# Altium project KATADC_V1-3.PrjPCB (part 2 of 3)

## Sheet ADC-QCHANNEL INPUT.SchDoc: <SPECIFIC SHEET FUNCTION>
size A3; Date: DO NOT USE, RATHER USE PROJ OPTIONS; DrawnBy: DO NOT USE, RATHER USE PROJ OPTIONS; Engineer: DO NOT USE, RATHER USE PROJ OPTIONS; Organization: DO NOT USE, RATHER USE PROJ OPTIONS; DocumentNumber: 2; Revision: DO NOT USE, RATHER USE PROJ OPTIONS; SheetNumber: 2; SheetTotal: 12; SCH_Sheet_Filename: ADC-QCHANEL INPUT.SchDoc; CurrentTime: DO NOT USE, RATHER USE PROJ OPTIONS; Time: DO NOT USE, RATHER USE PROJ OPTIONS; DocumentFullPathAndName: DO NOT USE, RATHER USE PROJ OPTIONS; DocumentName: DO NOT USE, RATHER USE PROJ OPTIONS; ModifiedDate: DO NOT USE, RATHER USE PROJ OPTIONS; ImagePath: DO NOT USE, RATHER USE PROJ OPTIONS
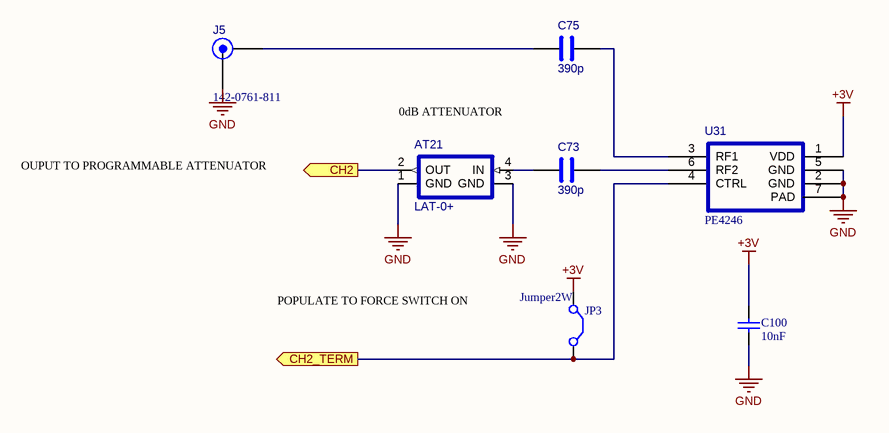
[diagram p6: ADC-QCHANNEL INPUT.SchDoc]

### Parts
AT21  (no value)  [MINICIRCUITS_MMM168]
C73  value 390p  [CAPC1005X55N]  (hidden comment: *)
C75  value 390p  [CAPC1005X55N]  (hidden comment: *)
C100  value 10nF  [CAPC1005X55N]  (hidden comment: Capacitor 0402 SMD)
J5  (no value)  [EDGE_LAUNCH_TH_SMA]
JP3  Jumper2W  [JUMPER]
U31  PE4246  [PSON95P300X300X90-7USR]

### Ports
CH2 (out), CH2_TERM (out)

### Nets
+3V: C100.1 JP3.1(C1) U31.1(VDD)
GND: AT21.1(GND) AT21.3(GND) C100.2 J5.2 U31.2(GND) U31.5(GND) U31.7(PAD)
CH2: AT21.2(OUT) ; port CH2
CH2_TERM: JP3.2(C2) U31.4(CTRL) ; port CH2_TERM
NetAT21_4: AT21.4(IN) C73.2
NetC73_1: C73.1 U31.6(RF2)
NetC75_1: C75.1 J5.1
NetC75_2: C75.2 U31.3(RF1)

### Notes on the sheet
- 0dB ATTENUATOR
- OUPUT TO PROGRAMMABLE ATTENUATOR
- POPULATE TO FORCE SWITCH ON
- 2009   THIS DOCUMENT IS THE PROPERTY OF THE OWNER, AND MAY NOT BE COPIED OR USED FOR ANY PURPOSE OTHER THAN THAT FOR WHICH IT IS SUPPLIED WITHOUT PERMISSION IN WRITING FROM THE OWNER.
- C
- DATESTAMP OF THIS PRINT
- DRAWN BY:
- DOCUMENT NUMBER:
- SCHEMATIC FILENAME:
- PCB FILENAME:
- ENGINEER:
- APPROVED:
- CIRCUIT DIAGRAM
- DATE
- SHEET
- REVISION
- OF

### Library data of the parts
AT21 = LAT-0+: Fixed Attenuator; Manufacturer: Mini-Circuits; Created_By: CT; Checked_By: *; Checked_Date: *; HelpURL: X:\Datasheets\By_Manufacturer\Mini Circuits\LAT-0+.pdf; ComponentLink1Description: Fixed Attenuator; ComponentLink1URL: *; ComponentLink2Description: Application Note; ComponentLink2URL: *; ComponentLink3Description: Layout Guidelines; ComponentLink3URL: *; ComponentLink4Description: Technology Reference; ComponentLink4URL: *; Supplier1: *; Supplier2: *; Unit_Cost: *; MOQ: *; Leadtime: *; Inventory_Stock: *; Tolerance: *; Wattage: *; Voltage: *; Package: *; ComponentLink5Description: Production Detail; ComponentLink5URL: *; Note: *; Stock Code: *; Manufacturer_PN: LAT-0+
C73 C75 = CAP-0603: CAP SMD 0603; Manufacturer: *; Manufacturer_PN: *; Created_By: *; Checked_By: *; Checked_Date: *; HelpURL: *; ComponentLink1Description: Footprint Detail; ComponentLink1URL: *; ComponentLink2Description: Application Note; ComponentLink2URL: *; ComponentLink3Description: Layout Guidelines; ComponentLink3URL: *; ComponentLink4Description: Technology Reference; ComponentLink4URL: *; Supplier1: *; Supplier2: *; Unit_Cost: *; MOQ: *; Leadtime: *; Inventory_Stock: *; Tolerance: *; Wattage: *; Voltage: *; Package: 0603; ComponentLink5Description: Production Detail; ComponentLink5URL: *; Note: *; Stock Code: *
C100 = cap0402: Created_By: EDA-ASA; Checked_By: *; Checked_Date: *; HelpURL: *; Supplier1: *; Supplier2: *; Unit_Cost: *; MOQ: *; Leadtime: *; Inventory_Stock: *; Tolerance: *; Wattage: *; Package: 0402; ComponentLinked1Description: *; ComponentLinked1URL: *; ComponentLinked2Description: *; ComponentLinked2URL: *; ComponentLinked3Description: *; ComponentLinked3URL: *; ComponentLinked4Description: *; ComponentLinked4URL: *
J5 = 142-0761-811: High Frequency SMA End Lauch Connector; Manufacturer: JOHNSON; Created_By: CT; Voltage: ???; Checked_By: *; Checked_Date: *; HelpURL: *; ComponentLink1Description: High Frequency SMA End Lauch Connector; ComponentLink1URL: *; ComponentLink2Description: Application Note; ComponentLink2URL: *; ComponentLink3Description: Layout Guidelines; ComponentLink3URL: *; ComponentLink4Description: Technology Reference; ComponentLink4URL: *; Supplier1: *; Supplier2: *; Unit_Cost: *; MOQ: *; Leadtime: *; Inventory_Stock: *; Tolerance: *; Wattage: *; Package: *; ComponentLink5Description: Production Detail; ComponentLink5URL: *; Note: *; Stock Code: *; Manufacturer_PN: 142-0761-811
JP3 = Jumper2W: Jumper Wire; Published: 24-Mar-1999; LatestRevisionDate: 17-Jul-2002; LatestRevisionNote: Re-released for DXP Platform.; PackageReference: RAD-0.2; Publisher: Altium Limited
U31 = PE4246: Absorptive SPST UltraCMOS RF Switch; Manufacturer: Pergrime Semiconductor; Created_By: IN; Manufacturer_PN: PE4246; Checked_By: *; Checked_Date: *; HelpURL: X:\Datasheets\By Manufacturer\Pergrime\pe4246ds.pdf; ComponentLink1Description: X:\Datasheets\By Manufacturer\Pergrime\pe4246ds.pdf#page=5; ComponentLink1URL: *; ComponentLink2Description: Application Note; ComponentLink2URL: *; ComponentLink3Description: Layout Guidelines; ComponentLink3URL: *; ComponentLink4Description: Technology Reference; ComponentLink4URL: *; Supplier1: *; Supplier2: *; Unit_Cost: *; MOQ: *; Leadtime: *; Inventory_Stock: *; Tolerance: *; Wattage: *; Voltage: *; Package: *; ComponentLink5Description: Production Detail; ComponentLink5URL: *; Note: *; Stock Code: *

## Sheet ADC-Q CHANNEL GAIN CONTROL.SchDoc: <SPECIFIC SHEET FUNCTION>
size A3; Date: DO NOT USE, RATHER USE PROJ OPTIONS; DrawnBy: DO NOT USE, RATHER USE PROJ OPTIONS; Engineer: DO NOT USE, RATHER USE PROJ OPTIONS; Organization: DO NOT USE, RATHER USE PROJ OPTIONS; DocumentNumber: 11; Revision: DO NOT USE, RATHER USE PROJ OPTIONS; SheetNumber: 11; SheetTotal: 12; SCH_Sheet_Filename: ADC-Q CHANNEL GAIN CONTROL.SchDoc; CurrentTime: DO NOT USE, RATHER USE PROJ OPTIONS; Time: DO NOT USE, RATHER USE PROJ OPTIONS; DocumentFullPathAndName: DO NOT USE, RATHER USE PROJ OPTIONS; DocumentName: DO NOT USE, RATHER USE PROJ OPTIONS; ModifiedDate: DO NOT USE, RATHER USE PROJ OPTIONS; ImagePath: DO NOT USE, RATHER USE PROJ OPTIONS
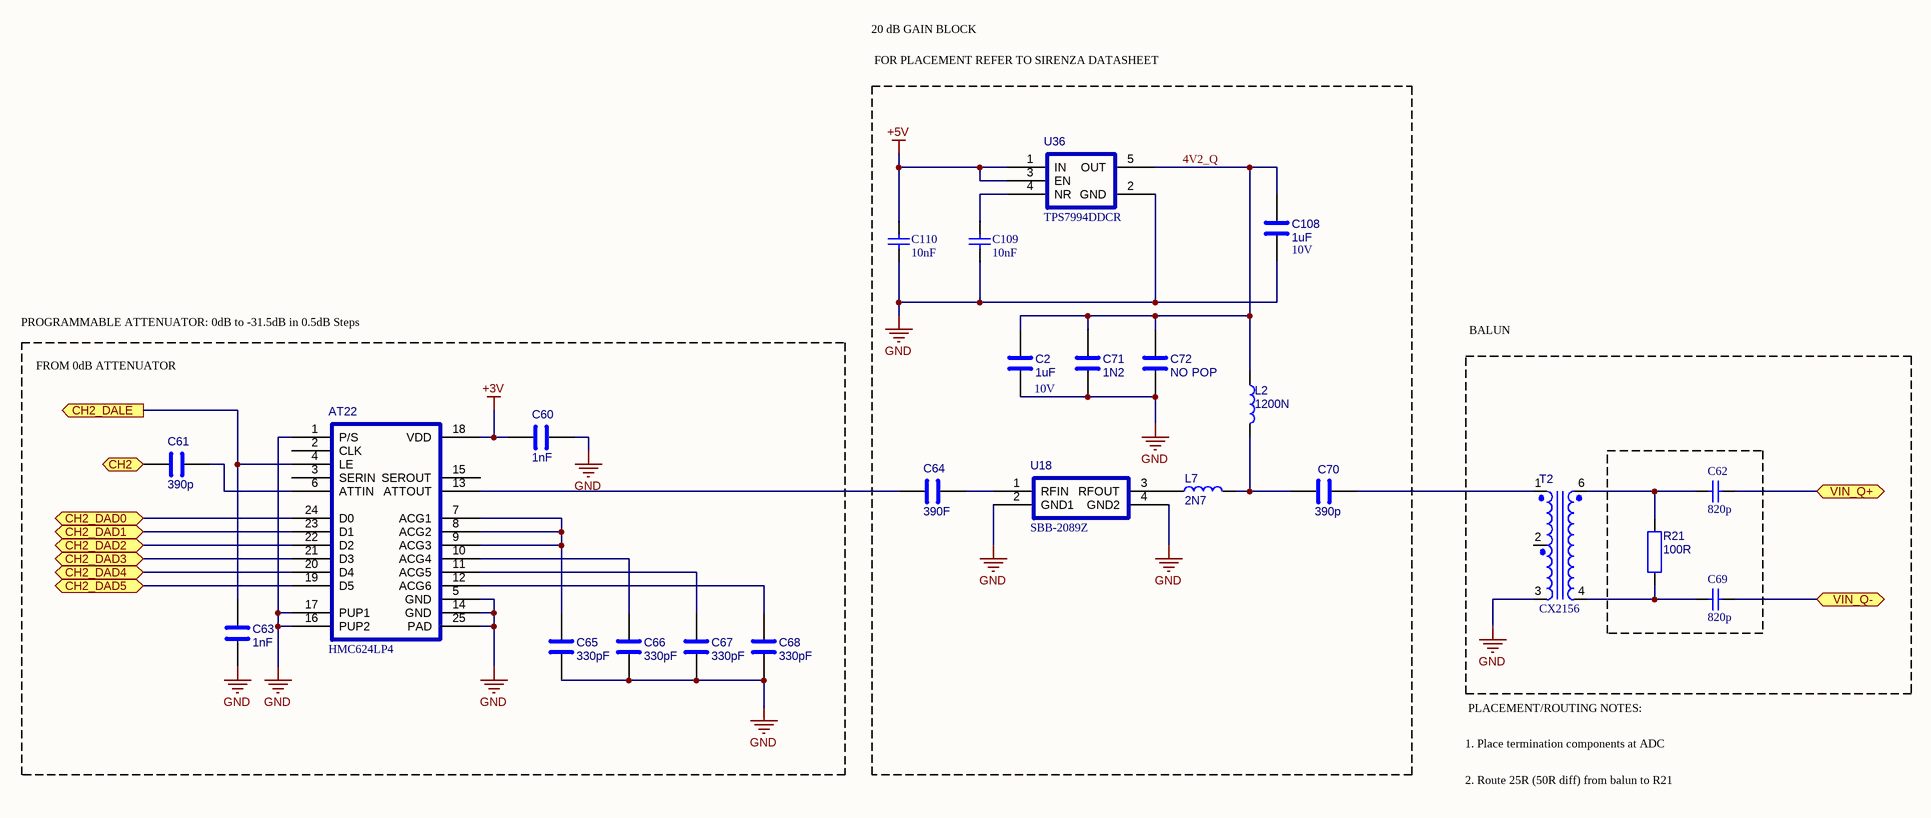
[diagram p7: ADC-Q CHANNEL GAIN CONTROL.SchDoc]

### Parts
AT22  HMC624LP4  [QFN50P400X400X100-25USR]
C2  value 1uF  Voltage: 10V  [CAPC1632X80USR]  (hidden comment: *)
C60  value 1nF  [0603]  (hidden comment: Footprint ???)
C61  value 390p  [CAPC1005X55N]  (hidden comment: *)
C62  value 820p  [CAPC1005X55N]  (hidden comment: Capacitor 0402 SMD)
C63  value 1nF  [0603]  (hidden comment: *)
C64  value 390F  [CAPC1005X55N]  (hidden comment: *)
C65  value 330pF  [0603]  (hidden comment: *)
C66  value 330pF  [0603]  (hidden comment: *)
C67  value 330pF  [0603]  (hidden comment: *)
C68  value 330pF  [0603]  (hidden comment: *)
C69  value 820p  [CAPC1005X55N]  (hidden comment: Capacitor 0402 SMD)
C70  value 390p  [CAPC1005X55N]  (hidden comment: Footprint ???)
C71  value 1N2  [CAPC1005X55N]  (hidden comment: *)
C72  value NO POP  [CAPC1005X55N]  (hidden comment: *)
C108  value 1uF  Voltage: 10V  [CAPC1632X80USR]  (hidden comment: Footprint ???)
C109  value 10nF  [CAPC1005X55N]  (hidden comment: Capacitor 0402 SMD)
C110  value 10nF  [CAPC1005X55N]  (hidden comment: Capacitor 0402 SMD)
L2  value 1200N  [INDM2520X160N]
L7  value 2N7  [INDC1005X60N]
R21  100R  [RESC1005X40N]
T2  CX2156  [PULSE_KAYAK]
U18  SBB-2089Z  [SIRENZA_SOT89]
U36  TPS7994DDCR  [SOT95P280X110-5USR]

### Ports
CH2 (out), CH2_DAD0, CH2_DAD1, CH2_DAD2, CH2_DAD3, CH2_DAD4, CH2_DAD5, CH2_DALE (out), VIN_Q+, VIN_Q-

### Nets
+3V: AT22.18(VDD) C60.1
+5V: C110.1 U36.1(IN) U36.3(EN)
GND: AT22.1(P/S) AT22.5(GND) AT22.14(GND) AT22.16(PUP2) AT22.17(PUP1) AT22.25(PAD) C2.2 C60.2 C63.2 C65.2 C66.2 C67.2 C68.2 C71.2 C72.2 C108.2 C109.2 C110.2 T2.3 U18.2(GND1) U18.4(GND2) U36.2(GND)
4V2_Q: C2.1 C71.1 C72.1 C108.1 L2.1 U36.5(OUT)
CH2: C61.1 ; port CH2
CH2_DAD0: AT22.24(D0) ; port CH2_DAD0
CH2_DAD1: AT22.23(D1) ; port CH2_DAD1
CH2_DAD2: AT22.22(D2) ; port CH2_DAD2
CH2_DAD3: AT22.21(D3) ; port CH2_DAD3
CH2_DAD4: AT22.20(D4) ; port CH2_DAD4
CH2_DAD5: AT22.19(D5) ; port CH2_DAD5
CH2_DALE: AT22.4(LE) C63.1 ; port CH2_DALE
VIN_Q+: C62.2 ; port VIN_Q+
VIN_Q-: C69.2 ; port VIN_Q-
NetAT22_6: AT22.6(ATTIN) C61.2
NetAT22_7: AT22.7(ACG1) AT22.8(ACG2) AT22.9(ACG3) C65.1
NetAT22_10: AT22.10(ACG4) C66.1
NetAT22_11: AT22.11(ACG5) C67.1
NetAT22_12: AT22.12(ACG6) C68.1
NetAT22_13: AT22.13(ATTOUT) C64.1
NetC62_1: C62.1 R21.1 T2.6
NetC64_2: C64.2 U18.1(RFIN)
NetC69_1: C69.1 R21.2 T2.4
NetC70_1: C70.1 L2.2 L7.2
NetC70_2: C70.2 T2.1
NetC109_1: C109.1 U36.4(NR)
NetL7_1: L7.1 U18.3(RFOUT)

Not connected (* = marked no-connect by the designer): AT22 2(CLK) 3(SERIN) 15(SEROUT); T2 2

### Notes on the sheet
- 20 dB GAIN BLOCK
- FOR PLACEMENT REFER TO SIRENZA DATASHEET
- PROGRAMMABLE ATTENUATOR: 0dB to -31.5dB in 0.5dB Steps
- FROM 0dB ATTENUATOR
- BALUN
- PLACEMENT/ROUTING NOTES:
- 1. Place termination components at ADC
- 2. Route 25R (50R diff) from balun to R21
- 2009   THIS DOCUMENT IS THE PROPERTY OF THE OWNER, AND MAY NOT BE COPIED OR USED FOR ANY PURPOSE OTHER THAN THAT FOR WHICH IT IS SUPPLIED WITHOUT PERMISSION IN WRITING FROM THE OWNER.
- C
- DATESTAMP OF THIS PRINT
- DRAWN BY:
- DOCUMENT NUMBER:
- SCHEMATIC FILENAME:
- PCB FILENAME:
- ENGINEER:
- APPROVED:
- CIRCUIT DIAGRAM
- DATE
- SHEET
- REVISION
- OF

### Library data of the parts
AT22 = HMC624LP4: Broadband 6-bit IC Digital Attenuator; Manufacturer: Hittite; Created_By: IN; Checked_By: NN; Manufacturer_PN: HMC624LP4; Checked_Date: NN-08-2009; HelpURL: X:\Datasheets\By_Manufacturer\Hittite\hmc624lp4.pdf; ComponentLink1Description: Footprint Detail; ComponentLink1URL: X:\Datasheets\By_Manufacturer\Hittite\hmc624lp4.pdf#page=6; ComponentLink2Description: Application Note; ComponentLink2URL: *; ComponentLink3Description: Layout Guidelines; ComponentLink3URL: X:\Datasheets\By_Manufacturer\Hittite\hmc624lp4.pdf#page=9; ComponentLink4Description: Technology Reference; ComponentLink4URL: *; Supplier1: *; Supplier2: *; Unit_Cost: *; MOQ: *; Leadtime: *; Inventory_Stock: *; Tolerance: *; Wattage: *; Voltage: *; Package: QFN24; ComponentLink5Description: Production Detail; ComponentLink5URL: *; Note: *; Stock Code: *
C2 C60 C61 C63-C68 C70-C72 C108 = CAP-0603: CAP SMD 0603; Manufacturer: *; Manufacturer_PN: *; Created_By: *; Checked_By: *; Checked_Date: *; HelpURL: *; ComponentLink1Description: Footprint Detail; ComponentLink1URL: *; ComponentLink2Description: Application Note; ComponentLink2URL: *; ComponentLink3Description: Layout Guidelines; ComponentLink3URL: *; ComponentLink4Description: Technology Reference; ComponentLink4URL: *; Supplier1: *; Supplier2: *; Unit_Cost: *; MOQ: *; Leadtime: *; Inventory_Stock: *; Tolerance: *; Wattage: *; Package: 0603; ComponentLink5Description: Production Detail; ComponentLink5URL: *; Note: *; Stock Code: *
  C60 C61 C63-C68 C70-C72: Voltage: *
C62 C69 C109 C110 = cap0402: Created_By: EDA-ASA; Checked_By: *; Checked_Date: *; HelpURL: *; Supplier1: *; Supplier2: *; Unit_Cost: *; MOQ: *; Leadtime: *; Inventory_Stock: *; Tolerance: *; Wattage: *; Package: 0402; ComponentLinked1Description: *; ComponentLinked1URL: *; ComponentLinked2Description: *; ComponentLinked2URL: *; ComponentLinked3Description: *; ComponentLinked3URL: *; ComponentLinked4Description: *; ComponentLinked4URL: *
L2 L7 = CHOKE: Created_By: EDA-ASA; Checked_By: *; Checked_Date: *; HelpURL: *; ComponentLinked1Description: *; ComponentLinked1URL: *; ComponentLinked2Description: *; ComponentLinked2URL: *; ComponentLinked3Description: *; ComponentLinked3URL: *; ComponentLinked4Description: *; ComponentLinked4URL: *; Supplier1: *; Supplier2: *; Unit_Cost: *; MOQ: *; Leadtime: *; Inventory_Stock: *; Tolerance: *; Wattage: *
R21 = RES-0805: RESISTOR SMD 0805; Checked_By: NN; Manufacturer: *; Manufacturer_PN: *; Created_By: *; Checked_Date: 5-08-2009; HelpURL: *; ComponentLink1Description: Footprint Detail; ComponentLink1URL: *; ComponentLink2Description: Application Note; ComponentLink2URL: *; ComponentLink3Description: Layout Guidelines; ComponentLink3URL: *; ComponentLink4Description: Technology Reference; ComponentLink4URL: *; Supplier1: *; Supplier2: *; Unit_Cost: *; MOQ: *; Leadtime: *; Inventory_Stock: *; Tolerance: *; Wattage: *; Voltage: *; Package: 0805; ComponentLink5Description: Production Detail; ComponentLink5URL: *; Note: *; Stock Code: *; Value: 100R
T2 = CX2156: TRANSFORMER WIDEBAND RF APPLICATION; Voltage: ???; Manufacturer: *; Created_By: *; Checked_By: *; Checked_Date: *; HelpURL: *; ComponentLink1Description: TRANSFORMER WIDEBAND RF APPLICATION; ComponentLink1URL: *; ComponentLink2Description: Application Note; ComponentLink2URL: *; ComponentLink3Description: Layout Guidelines; ComponentLink3URL: *; ComponentLink4Description: Technology Reference; ComponentLink4URL: *; Supplier1: *; Supplier2: *; Unit_Cost: *; MOQ: *; Leadtime: *; Inventory_Stock: *; Tolerance: *; Wattage: *; Package: *; ComponentLink5Description: Production Detail; ComponentLink5URL: *; Note: *; Stock Code: *; Manufacturer_PN: CX2156
U18 = SBB-2089Z: High performance InaGaP HBT MMIC amplfier; Manufacturer: Sirenza Micodevices; Created_By: IN; Manufacturer_PN: SBB-2089Z; Checked_By: *; Checked_Date: *; HelpURL: X:\Datasheets\By_Manufacturer\Sirenza\SBB-2089(Z)_Datasheet.pdf; ComponentLink1Description: Footprint Detail; ComponentLink1URL: X:\Datasheets\By_Manufacturer\Sirenza\SBB-2089(Z)_Datasheet.pdf#Page=5; ComponentLink2Description: Application Note; ComponentLink2URL: *; ComponentLink3Description: Layout Guidelines; ComponentLink3URL: *; ComponentLink4Description: Technology Reference; ComponentLink4URL: *; Supplier1: *; Supplier2: *; Unit_Cost: *; MOQ: *; Leadtime: *; Inventory_Stock: *; Tolerance: *; Wattage: *; Voltage: *; Package: *; ComponentLink5Description: Production Detail; ComponentLink5URL: *; Note: *; Stock Code: *
U36 = TPS7994DDCR: Low Quiescent Current, Ultra-Low Noise Dropout Linear Regulator; Manufacturer: TI; Created_By: IN; Manufacturer_PN: TPS7994DDCR; Checked_By: *; Checked_Date: *; HelpURL: X:\Datacheets\By_Manufacture\TI\296-17776-2.pdf; ComponentLink1Description: Footprint Detail; ComponentLink1URL: *; ComponentLink2Description: Application Note; ComponentLink2URL: *; ComponentLink3Description: Layout Guidelines; ComponentLink3URL: *; ComponentLink4Description: Technology Reference; ComponentLink4URL: *; Supplier1: *; Supplier2: *; Unit_Cost: *; MOQ: *; Leadtime: *; Inventory_Stock: *; Tolerance: *; Wattage: *; Voltage: *; Package: *; ComponentLink5Description: Production Detail; ComponentLink5URL: *; Note: *; Stock Code: *

## Sheet ADC-SYNC INPUT.SchDoc: <SPECIFIC SHEET FUNCTION>
size A3; Date: DO NOT USE, RATHER USE PROJ OPTIONS; DrawnBy: DO NOT USE, RATHER USE PROJ OPTIONS; Engineer: DO NOT USE, RATHER USE PROJ OPTIONS; Organization: DO NOT USE, RATHER USE PROJ OPTIONS; DocumentNumber: 9; Revision: DO NOT USE, RATHER USE PROJ OPTIONS; SheetNumber: 9; SheetTotal: 12; SCH_Sheet_Filename: ADC-SYNC INPUT.SchDoc; CurrentTime: DO NOT USE, RATHER USE PROJ OPTIONS; Time: DO NOT USE, RATHER USE PROJ OPTIONS; DocumentFullPathAndName: DO NOT USE, RATHER USE PROJ OPTIONS; DocumentName: DO NOT USE, RATHER USE PROJ OPTIONS; ModifiedDate: DO NOT USE, RATHER USE PROJ OPTIONS; ImagePath: DO NOT USE, RATHER USE PROJ OPTIONS
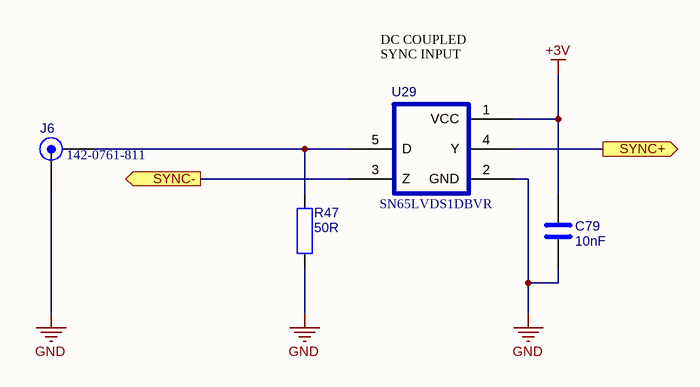
[diagram p8: ADC-SYNC INPUT.SchDoc]

### Parts
C79  value 10nF  [CAPC1005X55N]  (hidden comment: Footprint ???)
J6  (no value)  [EDGE_LAUNCH_TH_SMA]
R47  value 50R  [RESC1005X40N]  (hidden comment: *)
U29  SN65LVDS1DBVR  [SOT95P280X145-5N]

### Ports
SYNC+ (out), SYNC- (out)

### Nets
+3V: C79.2 U29.1(VCC)
GND: C79.1 J6.2 R47.2 U29.2(GND)
SYNC+: U29.4(Y) ; port SYNC+
SYNC-: U29.3(Z) ; port SYNC-
NetJ6_1: J6.1 R47.1 U29.5(D)

### Notes on the sheet
- DC COUPLED SYNC INPUT
- 2009   THIS DOCUMENT IS THE PROPERTY OF THE OWNER, AND MAY NOT BE COPIED OR USED FOR ANY PURPOSE OTHER THAN THAT FOR WHICH IT IS SUPPLIED WITHOUT PERMISSION IN WRITING FROM THE OWNER.
- C
- DATESTAMP OF THIS PRINT
- DRAWN BY:
- DOCUMENT NUMBER:
- SCHEMATIC FILENAME:
- PCB FILENAME:
- ENGINEER:
- APPROVED:
- CIRCUIT DIAGRAM
- DATE
- SHEET
- REVISION
- OF

### Library data of the parts
C79 = CAP-0603: CAP SMD 0603; Manufacturer: *; Manufacturer_PN: *; Created_By: *; Checked_By: *; Checked_Date: *; HelpURL: *; ComponentLink1Description: Footprint Detail; ComponentLink1URL: *; ComponentLink2Description: Application Note; ComponentLink2URL: *; ComponentLink3Description: Layout Guidelines; ComponentLink3URL: *; ComponentLink4Description: Technology Reference; ComponentLink4URL: *; Supplier1: *; Supplier2: *; Unit_Cost: *; MOQ: *; Leadtime: *; Inventory_Stock: *; Tolerance: *; Wattage: *; Voltage: *; Package: 0603; ComponentLink5Description: Production Detail; ComponentLink5URL: *; Note: *; Stock Code: *
J6 = 142-0761-811: as J5 on sheet ADC-QCHANNEL INPUT; Checked_By: *; Checked_Date: *; HelpURL: *; ComponentLink1Description: High Frequency SMA End Lauch Connector; ComponentLink1URL: *; ComponentLink2Description: Application Note; ComponentLink2URL: *; ComponentLink3Description: Layout Guidelines; ComponentLink3URL: *; ComponentLink4Description: Technology Reference; ComponentLink4URL: *; Supplier1: *; Supplier2: *; Unit_Cost: *; MOQ: *; Leadtime: *; Inventory_Stock: *; Tolerance: *; Wattage: *; Package: *; ComponentLink5Description: Production Detail; ComponentLink5URL: *; Note: *; Stock Code: *; Manufacturer_PN: 142-0761-811
R47 = RES-0805: RESISTOR SMD 0805; Checked_By: NN; Manufacturer: *; Manufacturer_PN: *; Created_By: *; Checked_Date: 5-08-2009; HelpURL: *; ComponentLink1Description: Footprint Detail; ComponentLink1URL: *; ComponentLink2Description: Application Note; ComponentLink2URL: *; ComponentLink3Description: Layout Guidelines; ComponentLink3URL: *; ComponentLink4Description: Technology Reference; ComponentLink4URL: *; Supplier1: *; Supplier2: *; Unit_Cost: *; MOQ: *; Leadtime: *; Inventory_Stock: *; Tolerance: *; Wattage: *; Voltage: *; Package: 0805; ComponentLink5Description: Production Detail; ComponentLink5URL: *; Note: *; Stock Code: *
U29 = SN65LVDS1DBVR: High Speed Differential Line Driver/Receiver; Manufacturer: TI; Created_By: IN; Manufacturer_PN: SN65LVDS1DBVR; Checked_By: *; Checked_Date: *; HelpURL: X:\Datasheets\By_Manufacturer\TI\sn65lvds1.pdf; ComponentLink1Description: X:\Datasheets\By_Manufacturer\TI\sn65lvds1.pdf#page=13; ComponentLink1URL: *; ComponentLink2Description: Application Note; ComponentLink2URL: *; ComponentLink3Description: Layout Guidelines; ComponentLink3URL: *; ComponentLink4Description: Technology Reference; ComponentLink4URL: *; Supplier1: *; Supplier2: *; Unit_Cost: *; MOQ: *; Leadtime: *; Inventory_Stock: *; Tolerance: *; Wattage: *; Voltage: *; Package: *; ComponentLink5Description: Production Detail; ComponentLink5URL: *; Note: *; Stock Code: *

## Sheet ADC-Z-DOK.SchDoc: <SPECIFIC SHEET FUNCTION>
size A3; Date: DO NOT USE, RATHER USE PROJ OPTIONS; DrawnBy: DO NOT USE, RATHER USE PROJ OPTIONS; Engineer: DO NOT USE, RATHER USE PROJ OPTIONS; Organization: DO NOT USE, RATHER USE PROJ OPTIONS; DocumentNumber: 6; Revision: DO NOT USE, RATHER USE PROJ OPTIONS; SheetNumber: 6; SheetTotal: 12; SCH_Sheet_Filename: ADC-Z-DOK.SchDoc; CurrentTime: DO NOT USE, RATHER USE PROJ OPTIONS; Time: DO NOT USE, RATHER USE PROJ OPTIONS; DocumentFullPathAndName: DO NOT USE, RATHER USE PROJ OPTIONS; DocumentName: DO NOT USE, RATHER USE PROJ OPTIONS; ModifiedDate: DO NOT USE, RATHER USE PROJ OPTIONS; ImagePath: DO NOT USE, RATHER USE PROJ OPTIONS
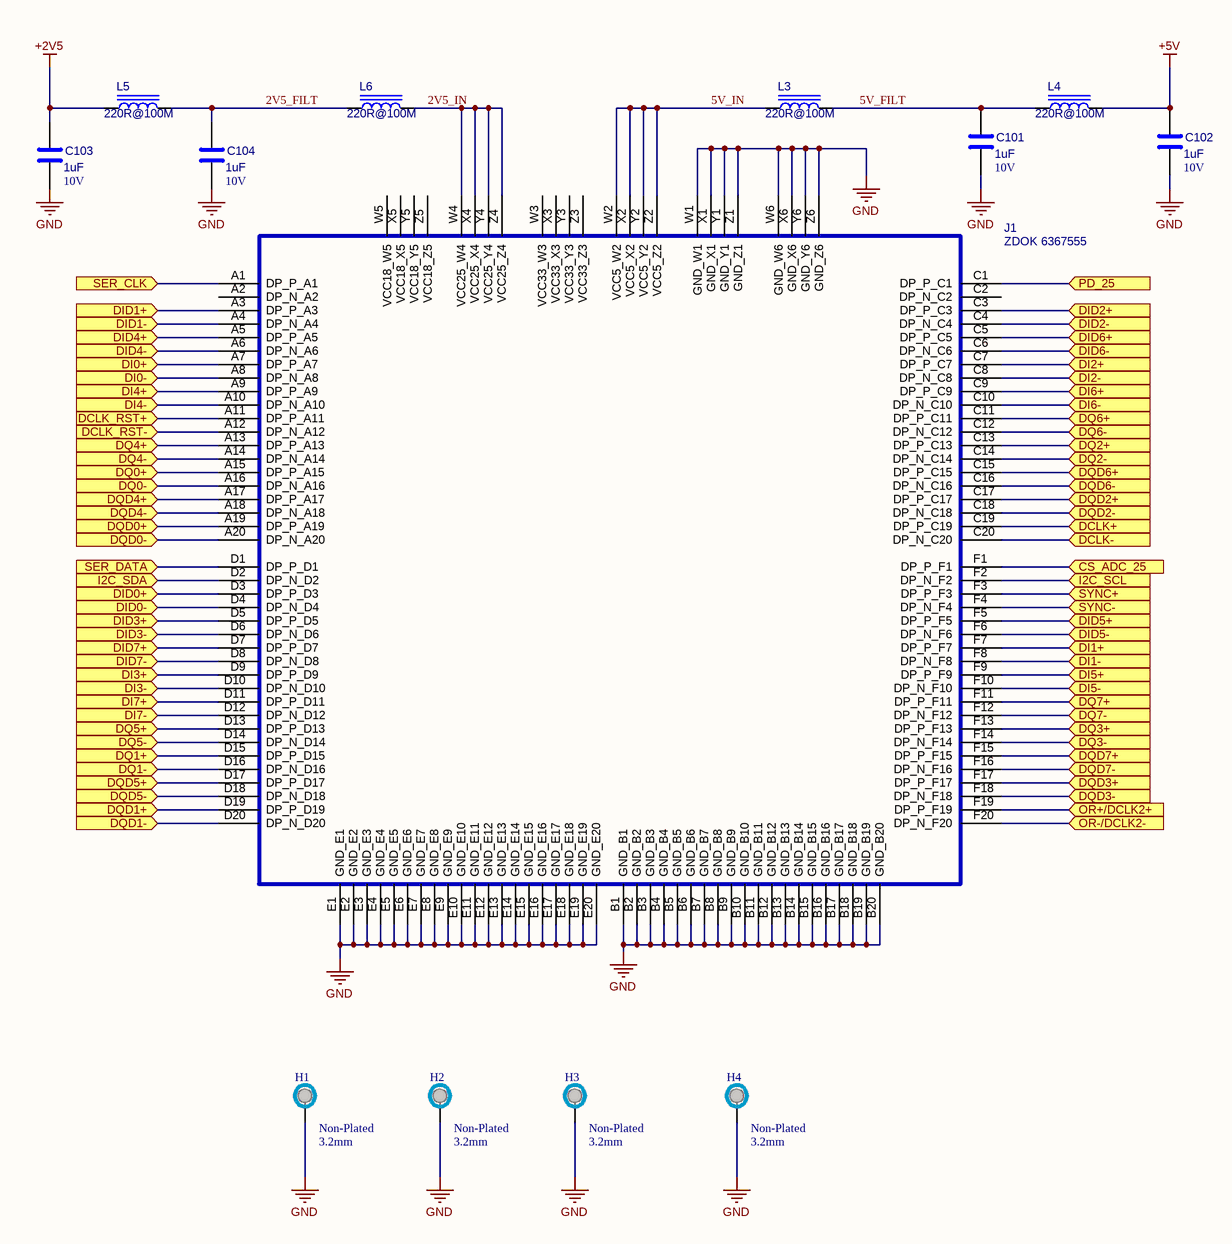
[diagram p9: ADC-Z-DOK.SchDoc]

### Parts
C101  value 1uF  Voltage: 10V  [CAPC1632X80USR]  (hidden comment: *)
C102  value 1uF  Voltage: 10V  [CAPC1632X80USR]  (hidden comment: *)
C103  value 1uF  Voltage: 10V  [CAPC1632X80USR]  (hidden comment: *)
C104  value 1uF  Voltage: 10V  [CAPC1632X80USR]  (hidden comment: *)
H1  Non-Plated  HoleDia: 3.2mm  [HOLE]  (no BOM)
H2  Non-Plated  HoleDia: 3.2mm  [HOLE]  (no BOM)
H3  Non-Plated  HoleDia: 3.2mm  [HOLE]  (no BOM)
H4  Non-Plated  HoleDia: 3.2mm  [HOLE]  (no BOM)
J1  Z-DOK  [TYCO6367555]  (value not drawn)
L3  Voltage: 220R@100M  [INDC1608X80USR]  (hidden comment: TDK)
L4  Voltage: 220R@100M  [INDC1608X80USR]  (hidden comment: TDK)
L5  Voltage: 220R@100M  [INDC1608X80USR]  (hidden comment: TDK)
L6  Voltage: 220R@100M  [INDC1608X80USR]  (hidden comment: TDK)

### Ports
CS_ADC_25 (in), DCLK+ (in), DCLK- (in), DCLK_RST+ (in), DCLK_RST- (in), DI0+ (in), DI0- (in), DI1+ (in), DI1- (in), DI2+ (in), DI2- (in), DI3+ (in), DI3- (in), DI4+ (in), DI4- (in), DI5+ (in), DI5- (in), DI6+ (in), DI6- (in), DI7+ (in), DI7- (in), DID0+ (in), DID0- (in), DID1+ (in), DID1- (in), DID2+ (in), DID2- (in), DID3+ (in), DID3- (in), DID4+ (in), DID4- (in), DID5+ (in), DID5- (in), DID6+ (in), DID6- (in), DID7+ (in), DID7- (in), DQ0+ (in), DQ0- (in), DQ1+ (in), DQ1- (in), DQ2+ (in), DQ2- (in), DQ3+ (in), DQ3- (in), DQ4+ (in), DQ4- (in), DQ5+ (in), DQ5- (in), DQ6+ (in), DQ6- (in), DQ7+ (in), DQ7- (in), DQD0+ (in), DQD0- (in), DQD1+ (in), DQD1- (in), DQD2+ (in), DQD2- (in), DQD3+ (in), DQD3- (in), DQD4+ (in), DQD4- (in), DQD5+ (in), DQD5- (in), DQD6+ (in), DQD6- (in), DQD7+ (in), DQD7- (in), I2C_SCL (in), I2C_SDA (in), OR+/DCLK2+ (in), OR-/DCLK2- (in), PD_25 (in), SER_CLK (in), SER_DATA (in), SYNC+ (in), SYNC- (in)

### Nets
+2V5: C103.1 L5.1
+5V: C102.1 L4.2
GND: C101.2 C102.2 C103.2 C104.2 H1.1(TP) H2.1(TP) H3.1(TP) H4.1(TP) J1.B1(GND_B1) J1.B2(GND_B2) J1.B3(GND_B3) J1.B4(GND_B4) J1.B5(GND_B5) J1.B6(GND_B6) J1.B7(GND_B7) J1.B8(GND_B8) J1.B9(GND_B9) J1.B10(GND_B10) J1.B11(GND_B11) J1.B12(GND_B12) J1.B13(GND_B13) J1.B14(GND_B14) J1.B15(GND_B15) J1.B16(GND_B16) J1.B17(GND_B17) J1.B18(GND_B18) J1.B19(GND_B19) J1.B20(GND_B20) J1.E1(GND_E1) J1.E2(GND_E2) J1.E3(GND_E3) J1.E4(GND_E4) J1.E5(GND_E5) J1.E6(GND_E6) J1.E7(GND_E7) J1.E8(GND_E8) J1.E9(GND_E9) J1.E10(GND_E10) J1.E11(GND_E11) J1.E12(GND_E12) J1.E13(GND_E13) J1.E14(GND_E14) J1.E15(GND_E15) J1.E16(GND_E16) J1.E17(GND_E17) J1.E18(GND_E18) J1.E19(GND_E19) J1.E20(GND_E20) J1.W1(GND_W1) J1.W6(GND_W6) J1.X1(GND_X1) J1.X6(GND_X6) J1.Y1(GND_Y1) J1.Y6(GND_Y6) J1.Z1(GND_Z1) J1.Z6(GND_Z6)
2V5_FILT: C104.1 L5.2 L6.1
2V5_IN: J1.W4(VCC25_W4) J1.X4(VCC25_X4) J1.Y4(VCC25_Y4) J1.Z4(VCC25_Z4) L6.2
5V_FILT: C101.1 L3.2 L4.1
5V_IN: J1.W2(VCC5_W2) J1.X2(VCC5_X2) J1.Y2(VCC5_Y2) J1.Z2(VCC5_Z2) L3.1
CS_ADC_25: J1.F1(DP_P_F1) ; port CS_ADC_25
DCLK+: J1.C19(DP_P_C19) ; port DCLK+
DCLK-: J1.C20(DP_N_C20) ; port DCLK-
DCLK_RST+: J1.A11(DP_P_A11) ; port DCLK_RST+
DCLK_RST-: J1.A12(DP_N_A12) ; port DCLK_RST-
DI0+: J1.A7(DP_P_A7) ; port DI0+
DI0-: J1.A8(DP_N_A8) ; port DI0-
DI1+: J1.F7(DP_P_F7) ; port DI1+
DI1-: J1.F8(DP_N_F8) ; port DI1-
DI2+: J1.C7(DP_P_C7) ; port DI2+
DI2-: J1.C8(DP_N_C8) ; port DI2-
DI3+: J1.D9(DP_P_D9) ; port DI3+
DI3-: J1.D10(DP_N_D10) ; port DI3-
DI4+: J1.A9(DP_P_A9) ; port DI4+
DI4-: J1.A10(DP_N_A10) ; port DI4-
DI5+: J1.F9(DP_P_F9) ; port DI5+
DI5-: J1.F10(DP_N_F10) ; port DI5-
DI6+: J1.C9(DP_P_C9) ; port DI6+
DI6-: J1.C10(DP_N_C10) ; port DI6-
DI7+: J1.D11(DP_P_D11) ; port DI7+
DI7-: J1.D12(DP_N_D12) ; port DI7-
DID0+: J1.D3(DP_P_D3) ; port DID0+
DID0-: J1.D4(DP_N_D4) ; port DID0-
DID1+: J1.A3(DP_P_A3) ; port DID1+
DID1-: J1.A4(DP_N_A4) ; port DID1-
DID2+: J1.C3(DP_P_C3) ; port DID2+
DID2-: J1.C4(DP_N_C4) ; port DID2-
DID3+: J1.D5(DP_P_D5) ; port DID3+
DID3-: J1.D6(DP_N_D6) ; port DID3-
DID4+: J1.A5(DP_P_A5) ; port DID4+
DID4-: J1.A6(DP_N_A6) ; port DID4-
DID5+: J1.F5(DP_P_F5) ; port DID5+
DID5-: J1.F6(DP_N_F6) ; port DID5-
DID6+: J1.C5(DP_P_C5) ; port DID6+
DID6-: J1.C6(DP_N_C6) ; port DID6-
DID7+: J1.D7(DP_P_D7) ; port DID7+
DID7-: J1.D8(DP_N_D8) ; port DID7-
DQ0+: J1.A15(DP_P_A15) ; port DQ0+
DQ0-: J1.A16(DP_N_A16) ; port DQ0-
DQ1+: J1.D15(DP_P_D15) ; port DQ1+
DQ1-: J1.D16(DP_N_D16) ; port DQ1-
DQ2+: J1.C13(DP_P_C13) ; port DQ2+
DQ2-: J1.C14(DP_N_C14) ; port DQ2-
DQ3+: J1.F13(DP_P_F13) ; port DQ3+
DQ3-: J1.F14(DP_N_F14) ; port DQ3-
DQ4+: J1.A13(DP_P_A13) ; port DQ4+
DQ4-: J1.A14(DP_N_A14) ; port DQ4-
DQ5+: J1.D13(DP_P_D13) ; port DQ5+
DQ5-: J1.D14(DP_N_D14) ; port DQ5-
DQ6+: J1.C11(DP_P_C11) ; port DQ6+
DQ6-: J1.C12(DP_N_C12) ; port DQ6-
DQ7+: J1.F11(DP_P_F11) ; port DQ7+
DQ7-: J1.F12(DP_N_F12) ; port DQ7-
DQD0+: J1.A19(DP_P_A19) ; port DQD0+
DQD0-: J1.A20(DP_N_A20) ; port DQD0-
DQD1+: J1.D19(DP_P_D19) ; port DQD1+
DQD1-: J1.D20(DP_N_D20) ; port DQD1-
DQD2+: J1.C17(DP_P_C17) ; port DQD2+
DQD2-: J1.C18(DP_N_C18) ; port DQD2-
DQD3+: J1.F17(DP_P_F17) ; port DQD3+
DQD3-: J1.F18(DP_N_F18) ; port DQD3-
DQD4+: J1.A17(DP_P_A17) ; port DQD4+
DQD4-: J1.A18(DP_N_A18) ; port DQD4-
DQD5+: J1.D17(DP_P_D17) ; port DQD5+
DQD5-: J1.D18(DP_N_D18) ; port DQD5-
DQD6+: J1.C15(DP_P_C15) ; port DQD6+
DQD6-: J1.C16(DP_N_C16) ; port DQD6-
DQD7+: J1.F15(DP_P_F15) ; port DQD7+
DQD7-: J1.F16(DP_N_F16) ; port DQD7-
I2C_SCL: J1.F2(DP_N_F2) ; port I2C_SCL
I2C_SDA: J1.D2(DP_N_D2) ; port I2C_SDA
OR+/DCLK2+: J1.F19(DP_P_F19) ; port OR+/DCLK2+
OR-/DCLK2-: J1.F20(DP_N_F20) ; port OR-/DCLK2-
PD_25: J1.C1(DP_P_C1) ; port PD_25
SER_CLK: J1.A1(DP_P_A1) ; port SER_CLK
SER_DATA: J1.D1(DP_P_D1) ; port SER_DATA
SYNC+: J1.F3(DP_P_F3) ; port SYNC+
SYNC-: J1.F4(DP_N_F4) ; port SYNC-

Not connected (* = marked no-connect by the designer): J1 A2(DP_N_A2) C2(DP_N_C2) W3(VCC33_W3) W5(VCC18_W5) X3(VCC33_X3) X5(VCC18_X5) Y3(VCC33_Y3) Y5(VCC18_Y5) Z3(VCC33_Z3) Z5(VCC18_Z5)

### Notes on the sheet
- 2009   THIS DOCUMENT IS THE PROPERTY OF THE OWNER, AND MAY NOT BE COPIED OR USED FOR ANY PURPOSE OTHER THAN THAT FOR WHICH IT IS SUPPLIED WITHOUT PERMISSION IN WRITING FROM THE OWNER.
- C
- DATESTAMP OF THIS PRINT
- DRAWN BY:
- DOCUMENT NUMBER:
- SCHEMATIC FILENAME:
- PCB FILENAME:
- ENGINEER:
- APPROVED:
- CIRCUIT DIAGRAM
- DATE
- SHEET
- REVISION
- OF

### Library data of the parts
C101-C104 = CAP-0603: CAP SMD 0603; Manufacturer: *; Manufacturer_PN: *; Created_By: *; Checked_By: *; Checked_Date: *; HelpURL: *; ComponentLink1Description: Footprint Detail; ComponentLink1URL: *; ComponentLink2Description: Application Note; ComponentLink2URL: *; ComponentLink3Description: Layout Guidelines; ComponentLink3URL: *; ComponentLink4Description: Technology Reference; ComponentLink4URL: *; Supplier1: *; Supplier2: *; Unit_Cost: *; MOQ: *; Leadtime: *; Inventory_Stock: *; Tolerance: *; Wattage: *; Package: 0603; ComponentLink5Description: Production Detail; ComponentLink5URL: *; Note: *; Stock Code: *
H1-H4 = Unplated Hole_3.2mm: PCB Mounting Hole; Category: Mounting Hole
J1 = ZDOK 6367555: Created_By: CT; Manufacturer: Z-DOK; Checked_By: *; Checked_Date: *; HelpURL: ENG_CS_1773095_Backplane_Connectors_Z-DOK_1208.pdf; ComponentLink1Description: Footprint Detail; ComponentLink1URL: ENG_CS_1773095_Backplane_Connectors_Z-DOK_1208.pdf#page=4; ComponentLink2Description: Application Note; ComponentLink2URL: *; ComponentLink3Description: Layout Guidelines; ComponentLink3URL: *; ComponentLink4Description: Technology Reference; ComponentLink4URL: *; Supplier1: *; Supplier2: *; Unit_Cost: *; MOQ: *; Leadtime: *; Inventory_Stock: *; Tolerance: *; Wattage: *; Package: *; ComponentLink5Description: Production Detail; ComponentLink5URL: *; Note: *; Stock Code: *; Manufacturer_PN: ZDOK 6367555
L3-L6 = MPZ16085221A: POWER LINE; Manufacturer: TDK; Created_By: *; Checked_By: *; Checked_Date: *; HelpURL: *; ComponentLink1Description: Footprint Detail; ComponentLink1URL: *; ComponentLink2Description: Application Note; ComponentLink2URL: *; ComponentLink3Description: Layout Guidelines; ComponentLink3URL: *; ComponentLink4Description: Technology Reference; ComponentLink4URL: *; Supplier1: *; Supplier2: *; Unit_Cost: *; MOQ: *; Leadtime: *; Inventory_Stock: *; Tolerance: *; Wattage: *; Package: *; ComponentLink5Description: Production Detail; ComponentLink5URL: *; Note: *; Stock Code: *; Manufacturer_PN: MPZ16085221A

## Sheet ADC-ADC.SchDoc: <SPECIFIC SHEET FUNCTION>
size A3; Date: DO NOT USE, RATHER USE PROJ OPTIONS; DrawnBy: DO NOT USE, RATHER USE PROJ OPTIONS; Engineer: DO NOT USE, RATHER USE PROJ OPTIONS; Organization: DO NOT USE, RATHER USE PROJ OPTIONS; DocumentNumber: 10; Revision: DO NOT USE, RATHER USE PROJ OPTIONS; SheetNumber: 10; SheetTotal: 12; SCH_Sheet_Filename: ADC-ADC.SchDoc; CurrentTime: DO NOT USE, RATHER USE PROJ OPTIONS; Time: DO NOT USE, RATHER USE PROJ OPTIONS; DocumentFullPathAndName: DO NOT USE, RATHER USE PROJ OPTIONS; DocumentName: DO NOT USE, RATHER USE PROJ OPTIONS; ModifiedDate: DO NOT USE, RATHER USE PROJ OPTIONS; ImagePath: DO NOT USE, RATHER USE PROJ OPTIONS
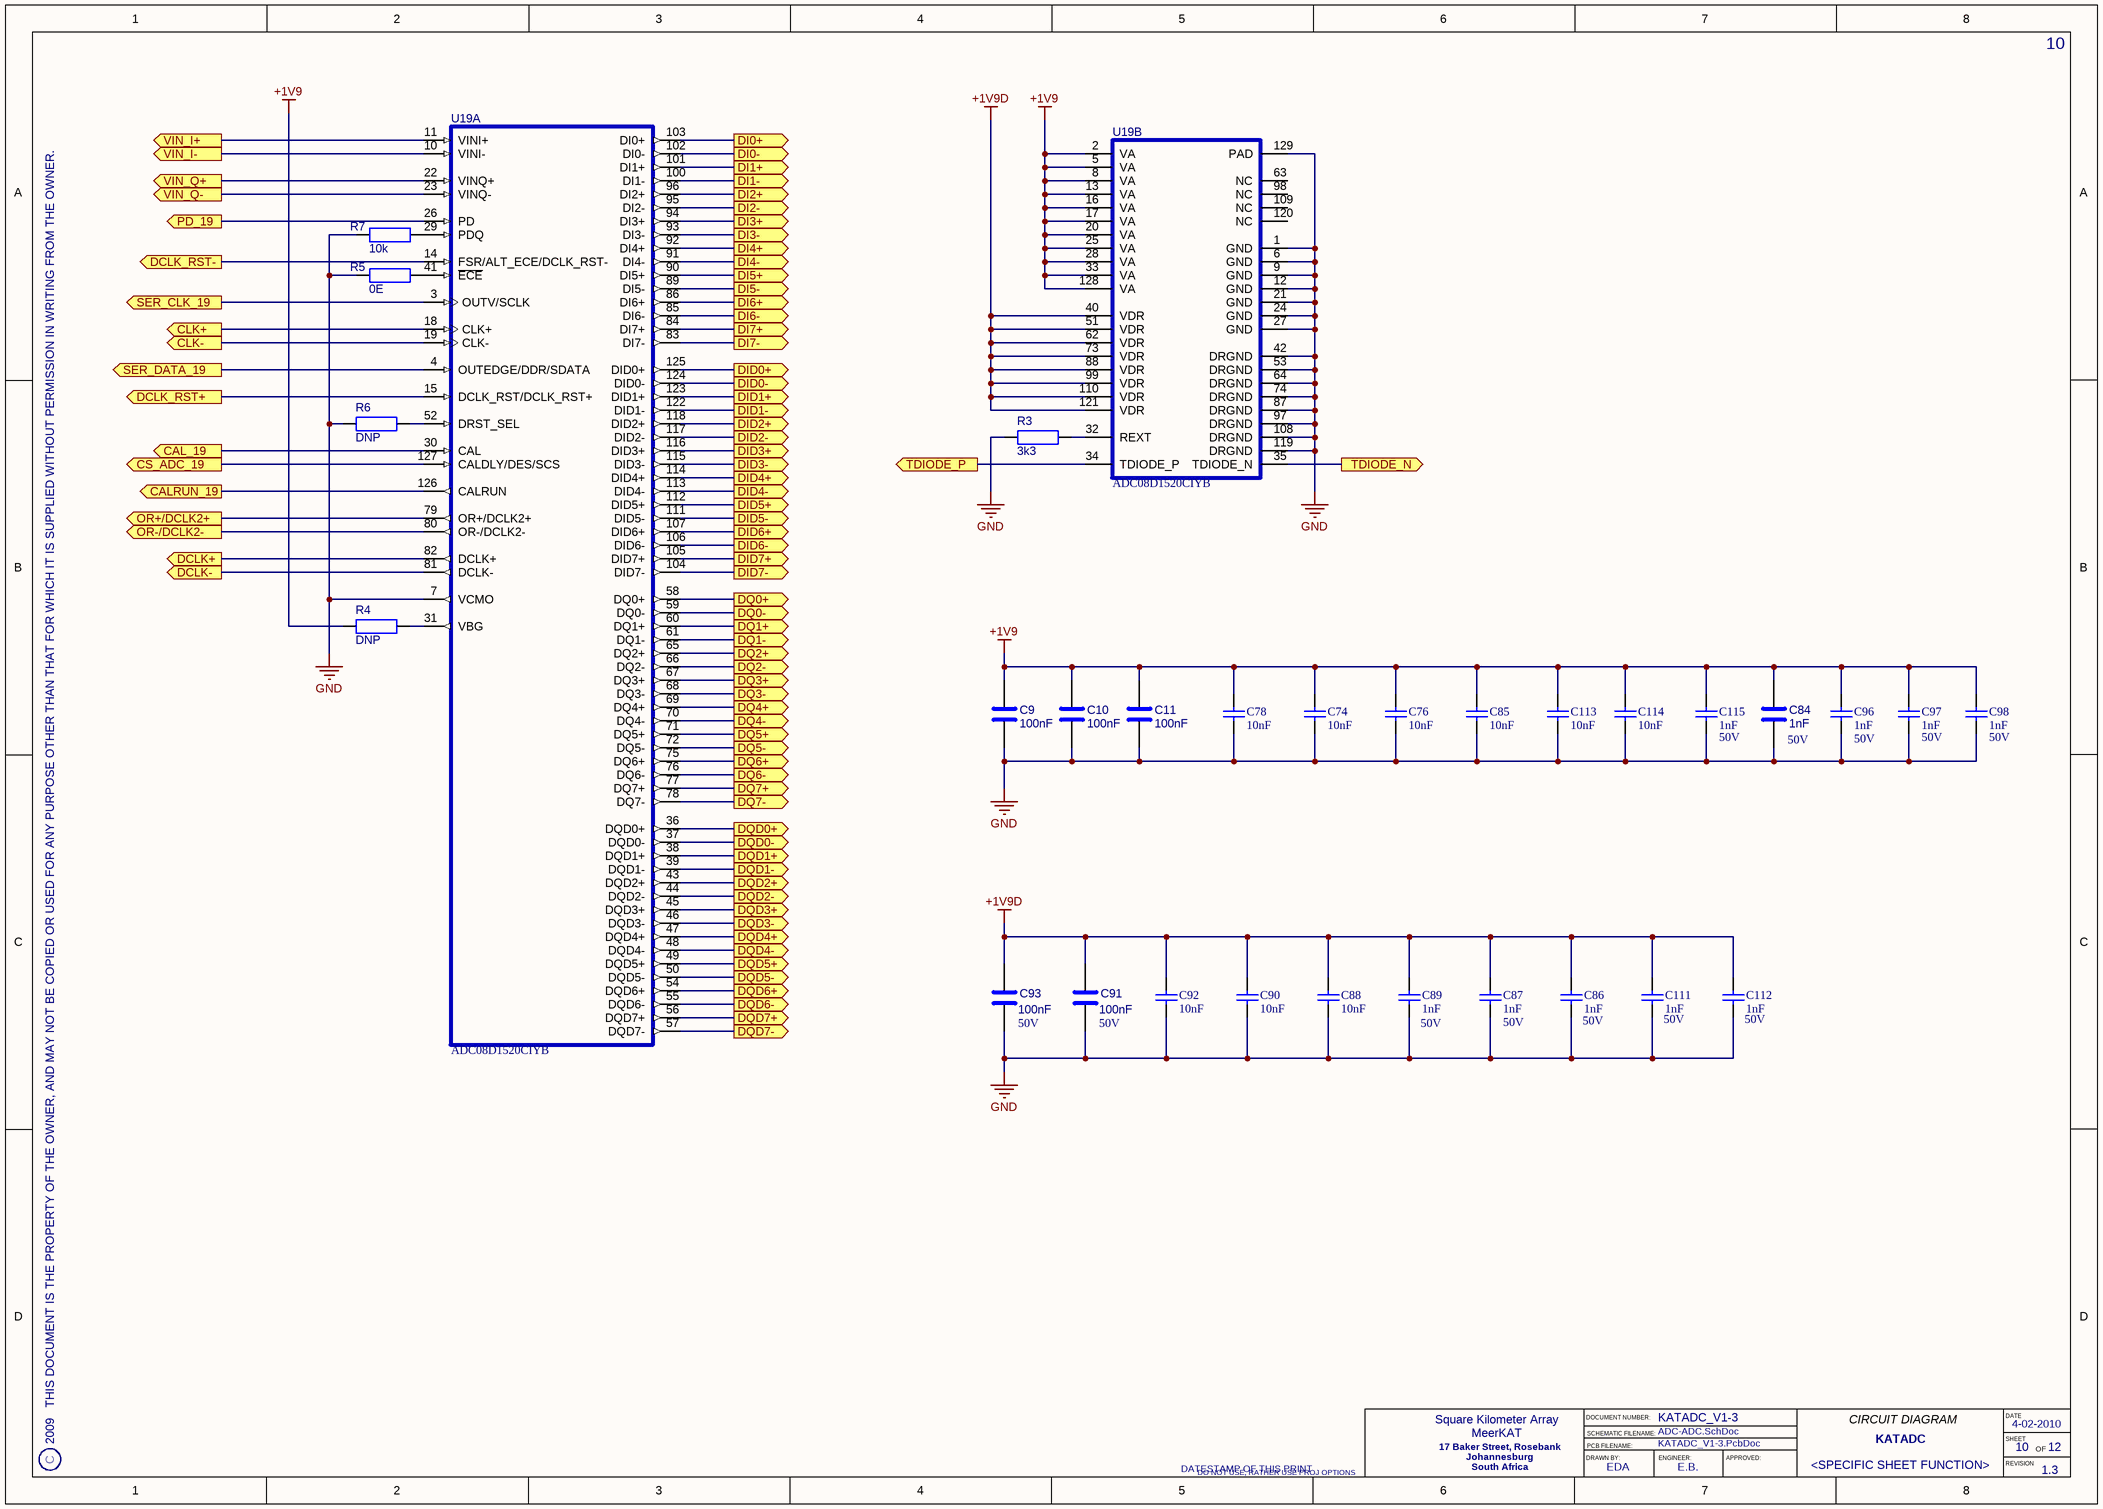
[diagram p10: ADC-ADC.SchDoc]

### Parts
C9  100nF  [0603]
C10  100nF  [0603]
C11  100nF  [0603]
C74  value 10nF  [CAPC1005X55N]  (hidden comment: Capacitor 0402 SMD)
C76  value 10nF  [CAPC1005X55N]  (hidden comment: Capacitor 0402 SMD)
C78  value 10nF  [CAPC1005X55N]  (hidden comment: Capacitor 0402 SMD)
C84  value 1nF  Voltage: 50V  [CAPC1005X55N]  (hidden comment: *)
C85  value 10nF  [CAPC1005X55N]  (hidden comment: Capacitor 0402 SMD)
C86  value 1nF  Voltage: 50V  [CAPC1005X55N]  (hidden comment: Capacitor 0402 SMD)
C87  value 1nF  Voltage: 50V  [CAPC1005X55N]  (hidden comment: Capacitor 0402 SMD)
C88  value 10nF  [CAPC1005X55N]  (hidden comment: Capacitor 0402 SMD)
C89  value 1nF  Voltage: 50V  [CAPC1005X55N]  (hidden comment: Capacitor 0402 SMD)
C90  value 10nF  [CAPC1005X55N]  (hidden comment: Capacitor 0402 SMD)
C91  value 100nF  Voltage: 50V  [0603]  (hidden comment: *)
C92  value 10nF  [CAPC1005X55N]  (hidden comment: Capacitor 0402 SMD)
C93  value 100nF  Voltage: 50V  [0603]  (hidden comment: *)
C96  value 1nF  Voltage: 50V  [CAPC1005X55N]  (hidden comment: Capacitor 0402 SMD)
C97  value 1nF  Voltage: 50V  [CAPC1005X55N]  (hidden comment: Capacitor 0402 SMD)
C98  value 1nF  Voltage: 50V  [CAPC1005X55N]  (hidden comment: Capacitor 0402 SMD)
C111  value 1nF  Voltage: 50V  [CAPC1005X55N]  (hidden comment: Capacitor 0402 SMD)
C112  value 1nF  Voltage: 50V  [CAPC1005X55N]  (hidden comment: Capacitor 0402 SMD)
C113  value 10nF  [CAPC1005X55N]  (hidden comment: Capacitor 0402 SMD)
C114  value 10nF  [CAPC1005X55N]  (hidden comment: Capacitor 0402 SMD)
C115  value 1nF  Voltage: 50V  [CAPC1005X55N]  (hidden comment: Capacitor 0402 SMD)
R3  3k3  [RESC1005X40N]
R4  DNP  [RESC1005X40N]
R5  0E  [RESC1005X40N]
R6  DNP  [RESC1005X40N]
R7  10k  [RESC1005X40N]
U19  ADC08D1520CIYB  [NS_VNX128A]  (parts A,B of 2)

### Ports
CAL_19 (out), CALRUN_19 (out), CLK+ (out), CLK- (out), CS_ADC_19 (out), DCLK+ (out), DCLK- (out), DCLK_RST+ (out), DCLK_RST- (out), DI0+ (out), DI0- (out), DI1+ (out), DI1- (out), DI2+ (out), DI2- (out), DI3+ (out), DI3- (out), DI4+ (out), DI4- (out), DI5+ (out), DI5- (out), DI6+ (out), DI6- (out), DI7+ (out), DI7- (out), DID0+ (out), DID0- (out), DID1+ (out), DID1- (out), DID2+ (out), DID2- (out), DID3+ (out), DID3- (out), DID4+ (out), DID4- (out), DID5+ (out), DID5- (out), DID6+ (out), DID6- (out), DID7+ (out), DID7- (out), DQ0+ (out), DQ0- (out), DQ1+ (out), DQ1- (out), DQ2+ (out), DQ2- (out), DQ3+ (out), DQ3- (out), DQ4+ (out), DQ4- (out), DQ5+ (out), DQ5- (out), DQ6+ (out), DQ6- (out), DQ7+ (out), DQ7- (out), DQD0+ (out), DQD0- (out), DQD1+ (out), DQD1- (out), DQD2+ (out), DQD2- (out), DQD3+ (out), DQD3- (out), DQD4+ (out), DQD4- (out), DQD5+ (out), DQD5- (out), DQD6+ (out), DQD6- (out), DQD7+ (out), DQD7- (out), OR+/DCLK2+ (out), OR-/DCLK2- (out), PD_19 (out), SER_CLK_19 (out), SER_DATA_19 (out), TDIODE_N (out), TDIODE_P (out), VIN_I+ (out), VIN_I- (out), VIN_Q+ (out), VIN_Q- (out)

### Nets
+1V9: C9.2 C10.2 C11.2 C74.1 C76.1 C78.1 C84.1 C85.1 C96.1 C97.1 C98.1 C113.1 C114.1 C115.1 R4.1 U19.2(VA) U19.5(VA) U19.8(VA) U19.13(VA) U19.16(VA) U19.17(VA) U19.20(VA) U19.25(VA) U19.28(VA) U19.33(VA) U19.128(VA)
+1V9D: C86.1 C87.1 C88.1 C89.1 C90.1 C91.1 C92.1 C93.1 C111.1 C112.1 U19.40(VDR) U19.51(VDR) U19.62(VDR) U19.73(VDR) U19.88(VDR) U19.99(VDR) U19.110(VDR) U19.121(VDR)
GND: C9.1 C10.1 C11.1 C74.2 C76.2 C78.2 C84.2 C85.2 C86.2 C87.2 C88.2 C89.2 C90.2 C91.2 C92.2 C93.2 C96.2 C97.2 C98.2 C111.2 C112.2 C113.2 C114.2 C115.2 R3.1 R5.1 R6.1 R7.1 U19.1(GND) U19.6(GND) U19.7(VCMO) U19.9(GND) U19.12(GND) U19.21(GND) U19.24(GND) U19.27(GND) U19.42(DRGND) U19.53(DRGND) U19.64(DRGND) U19.74(DRGND) U19.87(DRGND) U19.97(DRGND) U19.108(DRGND) U19.119(DRGND) U19.129(PAD)
CAL_19: U19.30(CAL) ; port CAL_19
CALRUN_19: U19.126(CALRUN) ; port CALRUN_19
CLK+: U19.18(CLK+) ; port CLK+
CLK-: U19.19(CLK-) ; port CLK-
CS_ADC_19: U19.127(CALDLY/DES/SCS) ; port CS_ADC_19
DCLK+: U19.82(DCLK+) ; port DCLK+
DCLK-: U19.81(DCLK-) ; port DCLK-
DCLK_RST+: U19.15(DCLK_RST/DCLK_RST+) ; port DCLK_RST+
DCLK_RST-: U19.14(FSR/ALT_ECE/DCLK_RST-) ; port DCLK_RST-
DI0+: U19.103(DI0+) ; port DI0+
DI0-: U19.102(DI0-) ; port DI0-
DI1+: U19.101(DI1+) ; port DI1+
DI1-: U19.100(DI1-) ; port DI1-
DI2+: U19.96(DI2+) ; port DI2+
DI2-: U19.95(DI2-) ; port DI2-
DI3+: U19.94(DI3+) ; port DI3+
DI3-: U19.93(DI3-) ; port DI3-
DI4+: U19.92(DI4+) ; port DI4+
DI4-: U19.91(DI4-) ; port DI4-
DI5+: U19.90(DI5+) ; port DI5+
DI5-: U19.89(DI5-) ; port DI5-
DI6+: U19.86(DI6+) ; port DI6+
DI6-: U19.85(DI6-) ; port DI6-
DI7+: U19.84(DI7+) ; port DI7+
DI7-: U19.83(DI7-) ; port DI7-
DID0+: U19.125(DID0+) ; port DID0+
DID0-: U19.124(DID0-) ; port DID0-
DID1+: U19.123(DID1+) ; port DID1+
DID1-: U19.122(DID1-) ; port DID1-
DID2+: U19.118(DID2+) ; port DID2+
DID2-: U19.117(DID2-) ; port DID2-
DID3+: U19.116(DID3+) ; port DID3+
DID3-: U19.115(DID3-) ; port DID3-
DID4+: U19.114(DID4+) ; port DID4+
DID4-: U19.113(DID4-) ; port DID4-
DID5+: U19.112(DID5+) ; port DID5+
DID5-: U19.111(DID5-) ; port DID5-
DID6+: U19.107(DID6+) ; port DID6+
DID6-: U19.106(DID6-) ; port DID6-
DID7+: U19.105(DID7+) ; port DID7+
DID7-: U19.104(DID7-) ; port DID7-
DQ0+: U19.58(DQ0+) ; port DQ0+
DQ0-: U19.59(DQ0-) ; port DQ0-
DQ1+: U19.60(DQ1+) ; port DQ1+
DQ1-: U19.61(DQ1-) ; port DQ1-
DQ2+: U19.65(DQ2+) ; port DQ2+
DQ2-: U19.66(DQ2-) ; port DQ2-
DQ3+: U19.67(DQ3+) ; port DQ3+
DQ3-: U19.68(DQ3-) ; port DQ3-
DQ4+: U19.69(DQ4+) ; port DQ4+
DQ4-: U19.70(DQ4-) ; port DQ4-
DQ5+: U19.71(DQ5+) ; port DQ5+
DQ5-: U19.72(DQ5-) ; port DQ5-
DQ6+: U19.75(DQ6+) ; port DQ6+
DQ6-: U19.76(DQ6-) ; port DQ6-
DQ7+: U19.77(DQ7+) ; port DQ7+
DQ7-: U19.78(DQ7-) ; port DQ7-
DQD0+: U19.36(DQD0+) ; port DQD0+
DQD0-: U19.37(DQD0-) ; port DQD0-
DQD1+: U19.38(DQD1+) ; port DQD1+
DQD1-: U19.39(DQD1-) ; port DQD1-
DQD2+: U19.43(DQD2+) ; port DQD2+
DQD2-: U19.44(DQD2-) ; port DQD2-
DQD3+: U19.45(DQD3+) ; port DQD3+
DQD3-: U19.46(DQD3-) ; port DQD3-
DQD4+: U19.47(DQD4+) ; port DQD4+
DQD4-: U19.48(DQD4-) ; port DQD4-
DQD5+: U19.49(DQD5+) ; port DQD5+
DQD5-: U19.50(DQD5-) ; port DQD5-
DQD6+: U19.54(DQD6+) ; port DQD6+
DQD6-: U19.55(DQD6-) ; port DQD6-
DQD7+: U19.56(DQD7+) ; port DQD7+
DQD7-: U19.57(DQD7-) ; port DQD7-
OR+/DCLK2+: U19.79(OR+/DCLK2+) ; port OR+/DCLK2+
OR-/DCLK2-: U19.80(OR-/DCLK2-) ; port OR-/DCLK2-
PD_19: U19.26(PD) ; port PD_19
SER_CLK_19: U19.3(OUTV/SCLK) ; port SER_CLK_19
SER_DATA_19: U19.4(OUTEDGE/DDR/SDATA) ; port SER_DATA_19
TDIODE_N: U19.35(TDIODE_N) ; port TDIODE_N
TDIODE_P: U19.34(TDIODE_P) ; port TDIODE_P
VIN_I+: U19.11(VINI+) ; port VIN_I+
VIN_I-: U19.10(VINI-) ; port VIN_I-
VIN_Q+: U19.22(VINQ+) ; port VIN_Q+
VIN_Q-: U19.23(VINQ-) ; port VIN_Q-
NetR3_2: R3.2 U19.32(REXT)
NetR4_2: R4.2 U19.31(VBG)
NetR5_2: R5.2 U19.41(~{ECE})
NetR6_2: R6.2 U19.52(DRST_SEL)
NetR7_2: R7.2 U19.29(PDQ)

Not connected (* = marked no-connect by the designer): U19 63(NC) 98(NC) 109(NC) 120(NC)

### Notes on the sheet
- 2009   THIS DOCUMENT IS THE PROPERTY OF THE OWNER, AND MAY NOT BE COPIED OR USED FOR ANY PURPOSE OTHER THAN THAT FOR WHICH IT IS SUPPLIED WITHOUT PERMISSION IN WRITING FROM THE OWNER.
- C
- DATESTAMP OF THIS PRINT
- DRAWN BY:
- DOCUMENT NUMBER:
- SCHEMATIC FILENAME:
- PCB FILENAME:
- ENGINEER:
- APPROVED:
- CIRCUIT DIAGRAM
- DATE
- SHEET
- REVISION
- OF

### Library data of the parts
C9-C11 C84 C91 C93 = CAP-0603: CAP SMD 0603; Manufacturer: *; Manufacturer_PN: *; Created_By: *; Checked_By: *; Checked_Date: *; HelpURL: *; ComponentLink1Description: Footprint Detail; ComponentLink1URL: *; ComponentLink2Description: Application Note; ComponentLink2URL: *; ComponentLink3Description: Layout Guidelines; ComponentLink3URL: *; ComponentLink4Description: Technology Reference; ComponentLink4URL: *; Supplier1: *; Supplier2: *; Unit_Cost: *; MOQ: *; Leadtime: *; Inventory_Stock: *; Tolerance: *; Wattage: *; Package: 0603; ComponentLink5Description: Production Detail; ComponentLink5URL: *; Note: *; Stock Code: *
  C9-C11: Voltage: *; Value: 100nF
C74 C76 C78 C85-C90 C92 C96-C98 C111-C115 = cap0402: Created_By: EDA-ASA; Checked_By: *; Checked_Date: *; HelpURL: *; Supplier1: *; Supplier2: *; Unit_Cost: *; MOQ: *; Leadtime: *; Inventory_Stock: *; Tolerance: *; Wattage: *; Package: 0402; ComponentLinked1Description: *; ComponentLinked1URL: *; ComponentLinked2Description: *; ComponentLinked2URL: *; ComponentLinked3Description: *; ComponentLinked3URL: *; ComponentLinked4Description: *; ComponentLinked4URL: *
R3-R7 = RES-0805: RESISTOR SMD 0805; Checked_By: NN; Manufacturer: *; Manufacturer_PN: *; Created_By: *; Checked_Date: 5-08-2009; HelpURL: *; ComponentLink1Description: Footprint Detail; ComponentLink1URL: *; ComponentLink2Description: Application Note; ComponentLink2URL: *; ComponentLink3Description: Layout Guidelines; ComponentLink3URL: *; ComponentLink4Description: Technology Reference; ComponentLink4URL: *; Supplier1: *; Supplier2: *; Unit_Cost: *; MOQ: *; Leadtime: *; Inventory_Stock: *; Tolerance: *; Wattage: *; Voltage: *; Package: 0805; ComponentLink5Description: Production Detail; ComponentLink5URL: *; Note: *; Stock Code: *
  R3: Value: 3k3
  R4 R6: Value: DNP
  R5: Value: 0E
  R7: Value: 10k
U19 = ADC08D1520CIYB: Low Power, 8-Bit, Dual 1.5 GSPS or Single 3.0 GSPS A/D Converter; Manufacturer: National Semiconductor; Created_By: IN; Manufacturer_PN: ADC08D1520CIYB; Checked_By: *; Checked_Date: *; HelpURL: X:\Datasheets\By_Manufacturer\National Semi\ADC08D1520.pdf; ComponentLink1Description: X:\Datasheets\By_Manufacturer\National Semi\ADC08D1520.pdf#page=4; ComponentLink1URL: *; ComponentLink2Description: Application Note; ComponentLink2URL: *; ComponentLink3Description: Layout Guidelines; ComponentLink3URL: *; ComponentLink4Description: Technology Reference; ComponentLink4URL: *; Supplier1: *; Supplier2: *; Unit_Cost: *; MOQ: *; Leadtime: *; Inventory_Stock: *; Tolerance: *; Wattage: *; Voltage: *; Package: *; ComponentLink5Description: Production Detail; ComponentLink5URL: *; Note: *; Stock Code: *

## Sheet ADC-POWER SUPPLY.SchDoc: <SPECIFIC SHEET FUNCTION>
size A3; Date: DO NOT USE, RATHER USE PROJ OPTIONS; DrawnBy: DO NOT USE, RATHER USE PROJ OPTIONS; Engineer: DO NOT USE, RATHER USE PROJ OPTIONS; Organization: DO NOT USE, RATHER USE PROJ OPTIONS; DocumentNumber: 12; Revision: DO NOT USE, RATHER USE PROJ OPTIONS; SheetNumber: 12; SheetTotal: 12; SCH_Sheet_Filename: ADC-POWER SUPPLY.SchDoc; CurrentTime: DO NOT USE, RATHER USE PROJ OPTIONS; Time: DO NOT USE, RATHER USE PROJ OPTIONS; DocumentFullPathAndName: DO NOT USE, RATHER USE PROJ OPTIONS; DocumentName: DO NOT USE, RATHER USE PROJ OPTIONS; ModifiedDate: DO NOT USE, RATHER USE PROJ OPTIONS; ImagePath: DO NOT USE, RATHER USE PROJ OPTIONS
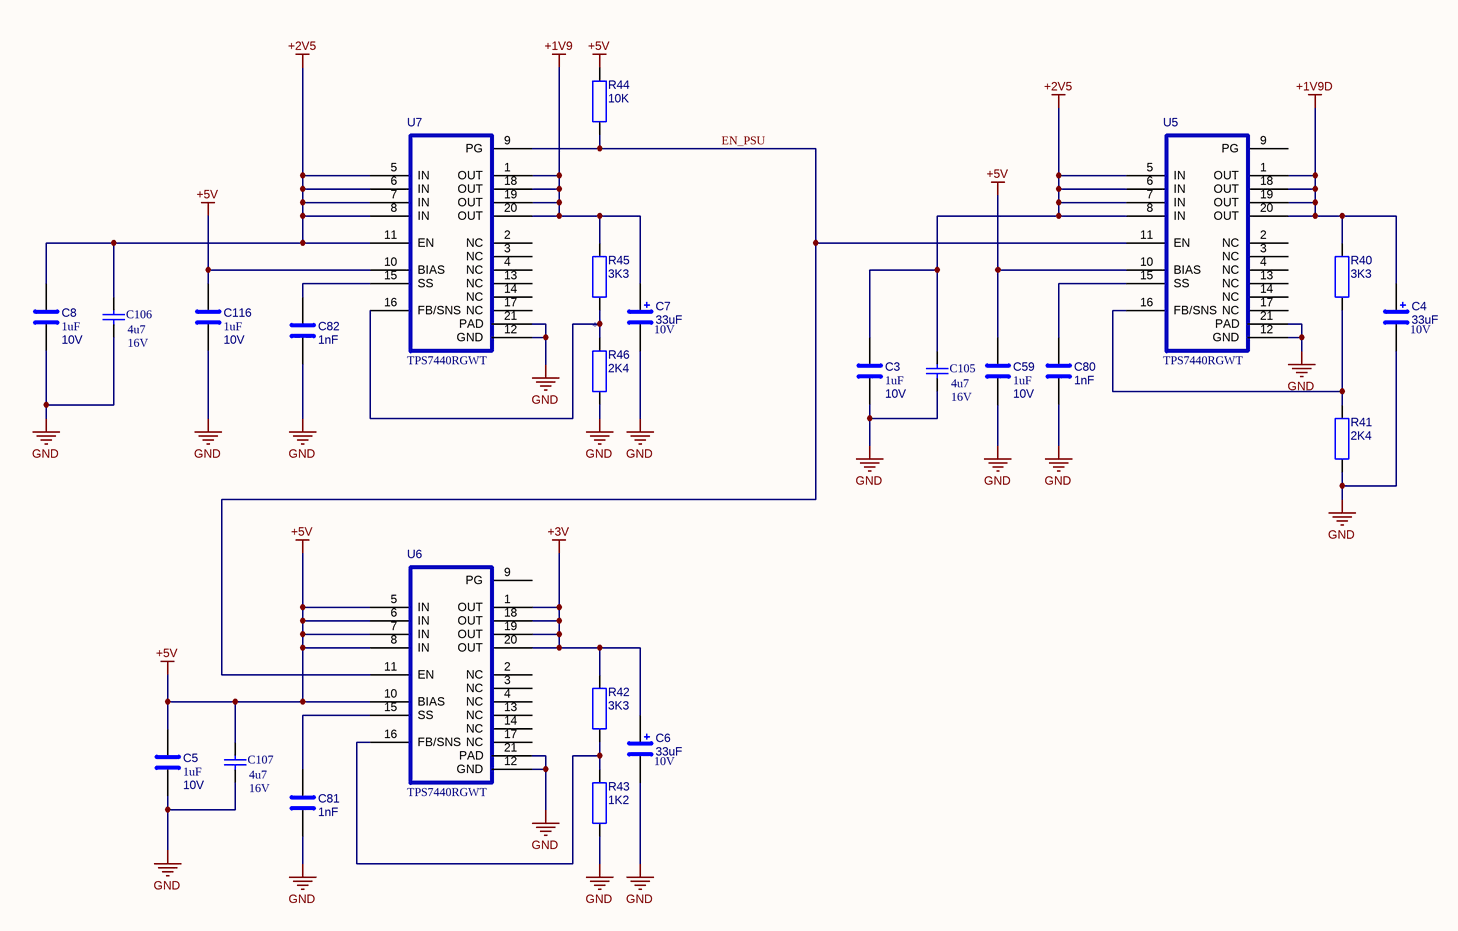
[diagram p11: ADC-POWER SUPPLY.SchDoc]

### Parts
C3  value 10V  Voltage: 1uF  [CAPC1632X80USR]  (hidden comment: Footprint ???)
C4  Voltage: 10V  [3528]  (hidden comment: 33uF)
C5  value 10V  Voltage: 1uF  [CAPC1632X80USR]  (hidden comment: Footprint ???)
C6  Voltage: 10V  [3528]  (hidden comment: 33uF)
C7  Voltage: 10V  [3528]  (hidden comment: 33uF)
C8  value 10V  Voltage: 1uF  [CAPC1632X80USR]  (hidden comment: Footprint ???)
C59  value 10V  Voltage: 1uF  [CAPC1632X80USR]  (hidden comment: Footprint ???)
C80  value 1nF  [0603]  (hidden comment: Footprint ???)
C81  value 1nF  [0603]  (hidden comment: Footprint ???)
C82  value 1nF  [0603]  (hidden comment: *)
C105  value 4u7  Voltage: 16V  [CAPC3225X220N]  (hidden comment: Capacitor 1210 SMD)
C106  value 4u7  Voltage: 16V  [CAPC3225X220N]  (hidden comment: Capacitor 1210 SMD)
C107  value 4u7  Voltage: 16V  [CAPC3225X220N]  (hidden comment: Capacitor 1210 SMD)
C116  value 10V  Voltage: 1uF  [CAPC1632X80USR]  (hidden comment: Footprint ???)
R40  3K3  [0603]
R41  2K4  [0603]
R42  3K3  [0603]
R43  1K2  [0603]
R44  10K  [0603]
R45  3K3  [0603]
R46  2K4  [0603]
U5  TPS7440RGWT  [QFN65P500X500X100-21AN]
U6  TPS7440RGWT  [QFN65P500X500X100-21AN]
U7  TPS7440RGWT  [QFN65P500X500X100-21AN]

### Nets
+1V9: C7.1 R45.1 U7.1(OUT) U7.18(OUT) U7.19(OUT) U7.20(OUT)
+1V9D: C4.1 R40.1 U5.1(OUT) U5.18(OUT) U5.19(OUT) U5.20(OUT)
+2V5: C3.1 C8.1 C105.2 C106.2 U5.5(IN) U5.6(IN) U5.7(IN) U5.8(IN) U7.5(IN) U7.6(IN) U7.7(IN) U7.8(IN) U7.11(EN)
+3V: C6.1 R42.1 U6.1(OUT) U6.18(OUT) U6.19(OUT) U6.20(OUT)
+5V: C5.1 C59.1 C107.2 C116.1 R44.1 U5.10(BIAS) U6.5(IN) U6.6(IN) U6.7(IN) U6.8(IN) U6.10(BIAS) U7.10(BIAS)
GND: C3.2 C4.2 C5.2 C6.2 C7.2 C8.2 C59.2 C80.2 C81.2 C82.2 C105.1 C106.1 C107.1 C116.2 R41.1 R43.1 R46.1 U5.12(GND) U5.21(PAD) U6.12(GND) U6.21(PAD) U7.12(GND) U7.21(PAD)
EN_PSU: R44.2 U5.11(EN) U6.11(EN) U7.9(PG)
NetC80_1: C80.1 U5.15(SS)
NetC81_1: C81.1 U6.15(SS)
NetC82_1: C82.1 U7.15(SS)
NetR40_2: R40.2 R41.2 U5.16(FB/SNS)
NetR42_2: R42.2 R43.2 U6.16(FB/SNS)
NetR45_2: R45.2 R46.2 U7.16(FB/SNS)

Not connected (* = marked no-connect by the designer): U5 2(NC) 3(NC) 4(NC) 9(PG) 13(NC) 14(NC) 17(NC); U6 2(NC) 3(NC) 4(NC) 9(PG) 13(NC) 14(NC) 17(NC); U7 2(NC) 3(NC) 4(NC) 13(NC) 14(NC) 17(NC)

### Notes on the sheet
- 2009   THIS DOCUMENT IS THE PROPERTY OF THE OWNER, AND MAY NOT BE COPIED OR USED FOR ANY PURPOSE OTHER THAN THAT FOR WHICH IT IS SUPPLIED WITHOUT PERMISSION IN WRITING FROM THE OWNER.
- C
- DATESTAMP OF THIS PRINT
- DRAWN BY:
- DOCUMENT NUMBER:
- SCHEMATIC FILENAME:
- PCB FILENAME:
- ENGINEER:
- APPROVED:
- CIRCUIT DIAGRAM
- DATE
- SHEET
- REVISION
- OF

### Library data of the parts
C3 C5 C8 C59 C80-C82 C116 = CAP-0603: CAP SMD 0603; Manufacturer: *; Manufacturer_PN: *; Created_By: *; Checked_By: *; Checked_Date: *; HelpURL: *; ComponentLink1Description: Footprint Detail; ComponentLink1URL: *; ComponentLink2Description: Application Note; ComponentLink2URL: *; ComponentLink3Description: Layout Guidelines; ComponentLink3URL: *; ComponentLink4Description: Technology Reference; ComponentLink4URL: *; Supplier1: *; Supplier2: *; Unit_Cost: *; MOQ: *; Leadtime: *; Inventory_Stock: *; Tolerance: *; Wattage: *; Package: 0603; ComponentLink5Description: Production Detail; ComponentLink5URL: *; Note: *; Stock Code: *
  C80-C82: Voltage: *
C4 C6 C7 = CAPACITOR-POLARISED: Created_By: EDA-ASA; Checked_By: *; Checked_Date: *; HelpURL: *; ComponentLinked1Description: *; ComponentLinked1URL: *; ComponentLinked2Description: *; ComponentLinked2URL: *; ComponentLinked3Description: *; ComponentLinked3URL: *; ComponentLinked4Description: *; ComponentLinked4URL: *; Supplier1: *; Supplier2: *; Unit_Cost: *; MOQ: *; Leadtime: *; Inventory_Stock: *; Tolerance: *; Wattage: *; Value: 33uF
C105-C107 = cap1210: Created_By: EDA-ASA; Checked_By: *; Checked_Date: *; HelpURL: *; Supplier1: *; Supplier2: *; Unit_Cost: *; MOQ: *; Leadtime: *; Inventory_Stock: *; Tolerance: *; Wattage: *; Package: 1210; ComponentLinked1Description: *; ComponentLinked1URL: *; ComponentLinked2Description: *; ComponentLinked2URL: *; ComponentLinked3Description: *; ComponentLinked3URL: *; ComponentLinked4Description: *; ComponentLinked4URL: *
R40-R46 = RES-0805: RESISTOR SMD 0805; Checked_By: NN; Manufacturer: *; Manufacturer_PN: *; Created_By: *; Checked_Date: 5-08-2009; HelpURL: *; ComponentLink1Description: Footprint Detail; ComponentLink1URL: *; ComponentLink2Description: Application Note; ComponentLink2URL: *; ComponentLink3Description: Layout Guidelines; ComponentLink3URL: *; ComponentLink4Description: Technology Reference; ComponentLink4URL: *; Supplier1: *; Supplier2: *; Unit_Cost: *; MOQ: *; Leadtime: *; Inventory_Stock: *; Tolerance: *; Wattage: *; Voltage: *; Package: 0805; ComponentLink5Description: Production Detail; ComponentLink5URL: *; Note: *; Stock Code: *
  R40 R42 R45: Value: 3K3
  R41 R46: Value: 2K4
  R43: Value: 1K2
  R44: Value: 10K
U5-U7 = TPS74401RGWT: 3.0A Ultra-LDO with Programmable Soft-Start; Manufacturer: TI; Created_By: IN; Manufacturer_PN: TPS7440RGWT; Checked_By: *; Checked_Date: *; HelpURL: X:\Datasheets\By Manufacturer\TI\tps74401.pdf; ComponentLink1Description: Footprint Detail; ComponentLink1URL: X:\Datasheets\By Manufacturer\TI\tps74401.pdf#page=12; ComponentLink2Description: Application Note; ComponentLink2URL: X:\Datasheets\By Manufacturer\TI\tps74401.pdf#page=13; ComponentLink3Description: Layout Guidelines; ComponentLink3URL: X:\Datasheets\By Manufacturer\TI\tps74401.pdf#page=14; ComponentLink4Description: Technology Reference; ComponentLink4URL: X:\Datasheets\By Manufacturer\TI\tps74401.pdf#page=15; Supplier1: *; Supplier2: *; Unit_Cost: *; MOQ: *; Leadtime: *; Inventory_Stock: *; Tolerance: *; Wattage: *; Voltage: *; Package: *; ComponentLink5Description: Production Detail; ComponentLink5URL: *; Note: *; Stock Code: *